# Altium schematic sheet ad.SchDoc
size A4
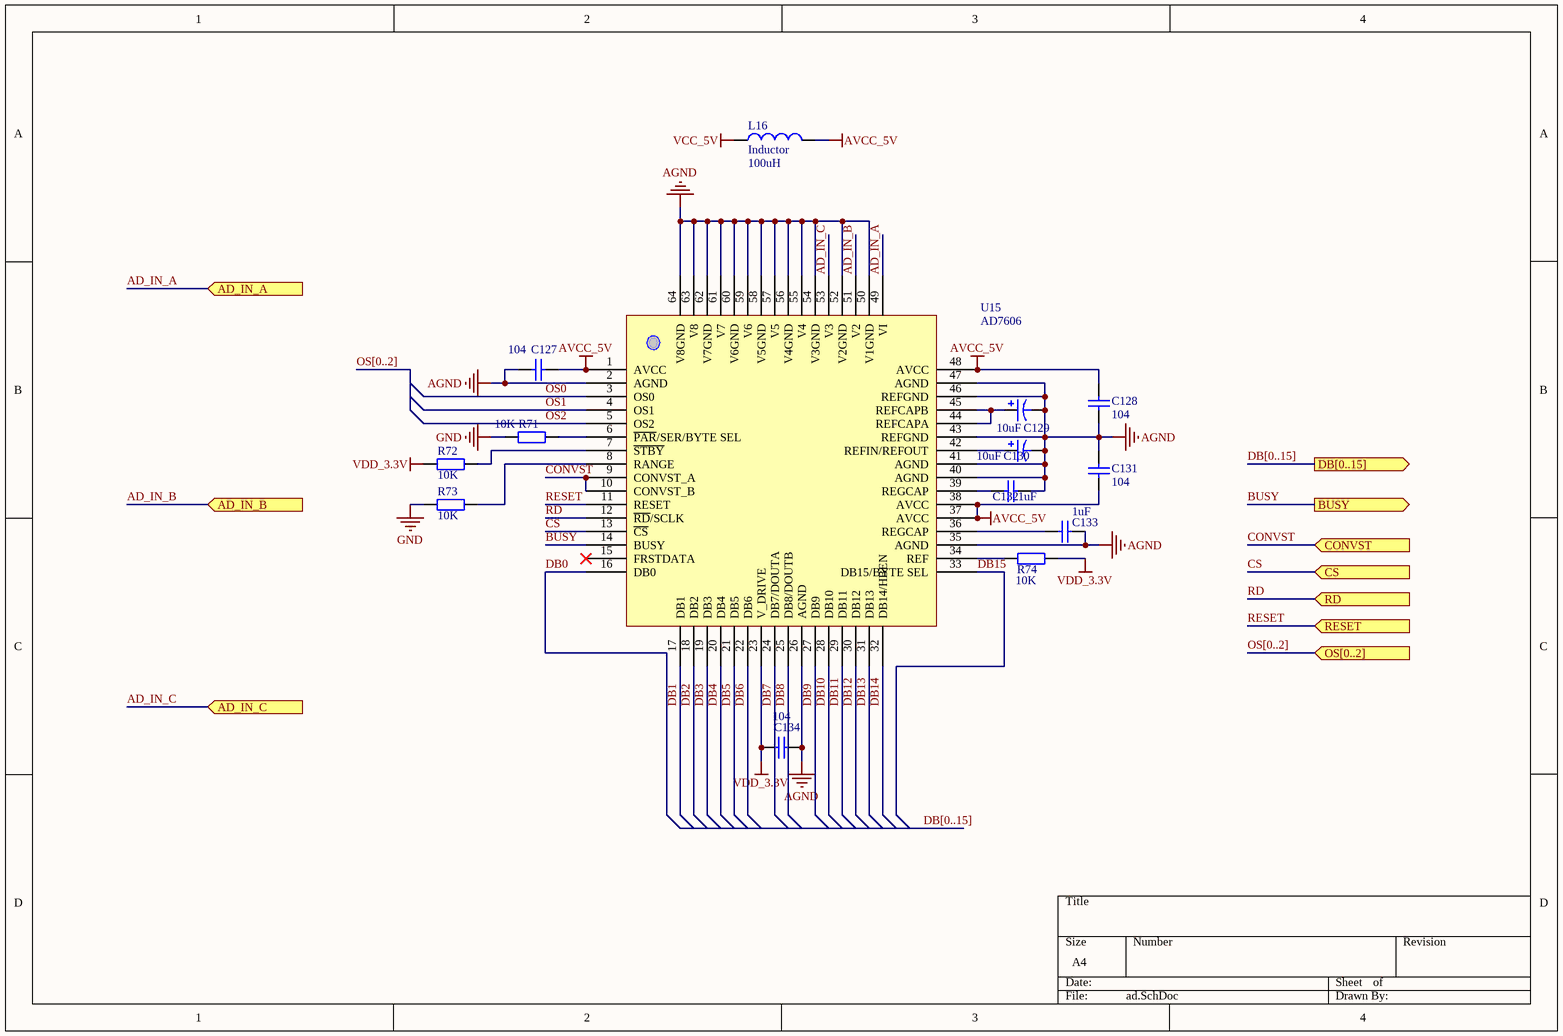
[diagram p0: ad.SchDoc]

## Parts
C127  value 104  [0603]  (hidden comment: Cap)
C128  value 104  [0603]  (hidden comment: Cap)
C129  value 10uF  [Cap 3528B]  (hidden comment: Cap Poll)
C130  value 10uF  [Cap 3528B]  (hidden comment: Cap Poll)
C131  value 104  [0603]  (hidden comment: Cap)
C132  value 1uF  [0603]  (hidden comment: Cap)
C133  value 1uF  [0603]  (hidden comment: Cap)
C134  value 104  [0603]  (hidden comment: Cap)
L16  Inductor  value 100uH  [0805_Inductor]
R71  value 10K  [0603]  (hidden comment: Res)
R72  value 10K  [0603]  (hidden comment: Res)
R73  value 10K  [0603]  (hidden comment: Res)
R74  value 10K  [0603]  (hidden comment: Res)
U15  AD7606  [TSQFP50P1200X1200X160-64N]

## Ports
AD_IN_A (in), AD_IN_B (in), AD_IN_C (in), BUSY (out), CONVST (in), CS (in), DB[0..15] (out), OS[0..2] (in), RD (in), RESET (in)

## Nets
AGND: C127.2 C128.2 C129.2 C130.2 C131.1 C132.1 C133.1 C134.1 U15.2(AGND) U15.26(AGND) U15.35(AGND) U15.40(AGND) U15.41(AGND) U15.43(REFGND) U15.46(REFGND) U15.47(AGND) U15.50(V1GND) U15.52(V2GND) U15.54(V3GND) U15.55(V4) U15.56(V4GND) U15.57(V5) U15.58(V5GND) U15.59(V6) U15.60(V6GND) U15.61(V7) U15.62(V7GND) U15.63(V8) U15.64(V8GND)
AVCC_5V: C127.1 C128.1 C131.2 L16.2 U15.1(AVCC) U15.37(AVCC) U15.38(AVCC) U15.48(AVCC)
GND: R71.1 R73.1
VCC_5V: L16.1
VDD_3.3V: C134.2 R72.1 R74.2 U15.23(V_DRIVE)
AD_IN_A: U15.49(VI) ; port AD_IN_A
AD_IN_B: U15.51(V2) ; port AD_IN_B
AD_IN_C: U15.53(V3) ; port AD_IN_C
BUSY: U15.14(BUSY) ; port BUSY
CONVST: U15.9(CONVST_A) U15.10(CONVST_B) ; port CONVST
CS: U15.13(~{CS}) ; port CS
DB0: U15.16(DB0)
DB1: U15.17(DB1)
DB2: U15.18(DB2)
DB3: U15.19(DB3)
DB4: U15.20(DB4)
DB5: U15.21(DB5)
DB6: U15.22(DB6)
DB7: U15.24(DB7/DOUTA)
DB8: U15.25(DB8/DOUTB)
DB9: U15.27(DB9)
DB10: U15.28(DB10)
DB11: U15.29(DB11)
DB12: U15.30(DB12)
DB13: U15.31(DB13)
DB14: U15.32(DB14/HBEN)
DB15: U15.33(DB15/BYTE_SEL)
OS0: U15.3(OS0)
OS1: U15.4(OS1)
OS2: U15.5(OS2)
RD: U15.12(~{RD}/SCLK) ; port RD
RESET: U15.11(RESET) ; port RESET
NetC129_1: C129.1 U15.44(REFCAPA) U15.45(REFCAPB)
NetC130_1: C130.1 U15.42(REFIN/REFOUT)
NetC132_2: C132.2 U15.39(REGCAP)
NetC133_2: C133.2 U15.36(REGCAP)
NetR71_2: R71.2 U15.6(~{PAR}/SER/BYTE_SEL)
NetR72_2: R72.2 U15.7(~{STBY})
NetR73_2: R73.2 U15.8(RANGE)
NetR74_1: R74.1 U15.34(REF)

Not connected (* = marked no-connect by the designer): U15 15(FRSTDATA)*

## Buses and harness runs
bus DB[0..15]
bus DB[0..15] = port DB[0..15]
bus OS[0..2]
bus OS[0..2] = port OS[0..2]

## Library data of the parts
C127 C128 C131-C134 = Cap: 原理图绘制者: 刘永钦; 原理图何处使用过: 2014年飞思卡尔底板; 原理图审核人1: 徐鹏飞; 封装0805何处使用: 2015年航行器遥控器; 原理图审核人2: 朱觉文; 封装0603何处使用过: 在2401转接板上使用; Pressure Voltage: 16V; 原理图提供者: 刘永钦; 封装0805绘制者: 刘永钦; 封装0805提供者: 刘永钦; 封装0805审核人1: 徐鹏飞; 封装0805审核人2: 朱觉文; 封装0603绘制者: 刘永钦; 封装0603提供者: 刘永钦; 封装0603审核人1: 朱觉文; 封装0603审核人2: 徐鹏飞
C129 C130 = Cap Poll: 原理图绘制者: 刘永钦; 原理图何处使用过: 2014年飞思卡尔底板; 原理图审核人1: 徐鹏飞; 封装CAP 钽 7343 E何处使用: 2014年飞思卡尔驱动板; 封装cap贴片铝电解质470uF 16V绘制者: 李泽; 封装cap贴片铝电解质470uF 16V何处使用: 2015年飞思卡尔主板; 封装Cap 3528B绘制者: 陈汉诚; 封装Cap 3528B使用过: 2015年飞思卡尔驱动板; 封装Cap直插 10uF 50V: 10级718学长; 封装Cap直插 10uF 50V使用过: 2012年XS128学习板的主板; 封装Cap 3528B审核人2: 朱觉文; Pressure Voltage: 16V; 原理图提供者: 刘永钦; 封装CAP 钽 7343 E绘制者: 刘永钦; 封装CAP 钽 7343 E提供者: 刘永钦; 封装CAP 钽 7343 E审核人1: 徐鹏飞; 封装cap贴片铝电解质470uF 16V提供者: 刘永钦; 封装cap贴片铝电解质470uF 16V审核人1: 徐鹏飞; 封装Cap 3528B提供者: 刘永钦; 封装Cap 3528B审核人1: 徐鹏飞; 封装Cap直插 10uF 50V提供者: 刘永钦; 封装Cap直插 10uF 50V审核人1: 徐鹏飞; 封装Cap直插 10uF 50V审核人2: 朱觉文; 封装cap贴片铝电解质470uF 16V审核人2: 朱觉文; 封装CAP 钽 7343 E审核人2: 朱觉文; 原理图审核人2: 朱觉文
L16 = Inductor: 原理图绘制者: 刘永钦; 原理图何处使用过: 2014年飞思卡尔底板; 原理图审核人1: 徐鹏飞; 封装0805_Inductor绘制者: 未知; 封装0805_Inductor使用过: 2015年飞思卡尔底板; 原理图审核人2: 朱觉文; 原理图提供者: 刘永钦; 封装0805_Inductor提供者: 刘永钦; 封装0805_Inductor审核人1: 徐鹏飞; 封装0805_Inductor审核人2: 朱觉文
R71-R74 = Res: 原理图绘制者: 刘永钦; 原理图何处使用过: 2014年飞思卡尔底板; 原理图审核人1: 徐鹏飞; 封装0805何处使用过: 2015年航行器遥控器; 原理图审核人2: 朱觉文; 封装2512-RESC6332X06N何处使用过: 在无刷直流电机驱动板上使用过; 封装0603何处使用过: 在2401转接板上使用; 原理图提供者: 刘永钦; 封装0805绘制者: 刘永钦; 封装0805提供者: 刘永钦; 封装0805审核人1: 徐鹏飞; 封装0805审核人2: 朱觉文; 封装0603提供者: 刘永钦; 封装0603审核人2: 朱觉文; 封装0603审核人1: 徐鹏飞; 封装2512-RESC6332X06N审核人2: 朱觉文; 封装2512-RESC6332X06N提供者: 刘永钦; 封装2512-RESC6332X06N审核人1: 徐鹏飞; 封装0603绘制者: 刘永钦; 封装2512-RESC6332X06N绘制者: 刘永钦